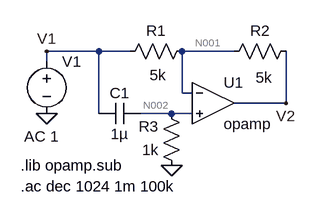
[diagram p0: schematic circuito1.asc]
circuito1.asc, the LTspice schematic file:
Version 4
SHEET 1 880 680
WIRE 96 96 16 96
WIRE 144 96 96 96
WIRE 304 96 224 96
WIRE 16 112 16 96
WIRE 224 160 224 96
WIRE 240 160 224 160
WIRE 384 176 384 96
WIRE 384 176 304 176
WIRE 96 192 96 96
WIRE 208 192 160 192
WIRE 240 192 208 192
FLAG 16 192 0
FLAG 208 272 0
FLAG 384 176 V2
FLAG 16 96 V1
SYMBOL res 240 80 R90
WINDOW 0 0 56 VBottom 2
WINDOW 3 37 53 VTop 2
SYMATTR InstName R1
SYMATTR Value 5k
SYMBOL res 400 80 R90
WINDOW 0 0 56 VBottom 2
WINDOW 3 41 50 VTop 2
SYMATTR InstName R2
SYMATTR Value 5k
SYMBOL res 224 288 R180
WINDOW 0 36 76 Left 2
WINDOW 3 36 40 Left 2
SYMATTR InstName R3
SYMATTR Value 1k
SYMBOL cap 160 176 R90
WINDOW 0 0 32 VBottom 2
WINDOW 3 32 32 VTop 2
SYMATTR InstName C1
SYMATTR Value 1µ
SYMBOL OpAmps\\opamp 272 112 R0
SYMATTR InstName U1
SYMBOL voltage 16 96 R0
WINDOW 123 -35 131 Left 2
WINDOW 39 0 0 Left 0
SYMATTR Value2 AC 1
SYMATTR InstName V1
SYMATTR Value ""
TEXT -24 272 Left 2 !.lib opamp.sub
TEXT -24 304 Left 2 !.ac dec 1024 1m 100k

The netlist it stands for:
* circuito1.asc
R1 N001 V1 5k
R2 V2 N001 5k
R3 0 N002 1k
C1 N002 V1 1µ
XU1 N001 N002 V2 opamp Aol=100K GBW=10Meg  ; pins invin noninvin out
V1 V1 0 AC 1
.lib opamp.sub
.ac dec 1024 1m 100k
.backanno
.end

* Results of the author's LTspice run, read from the files saved beside the schematic
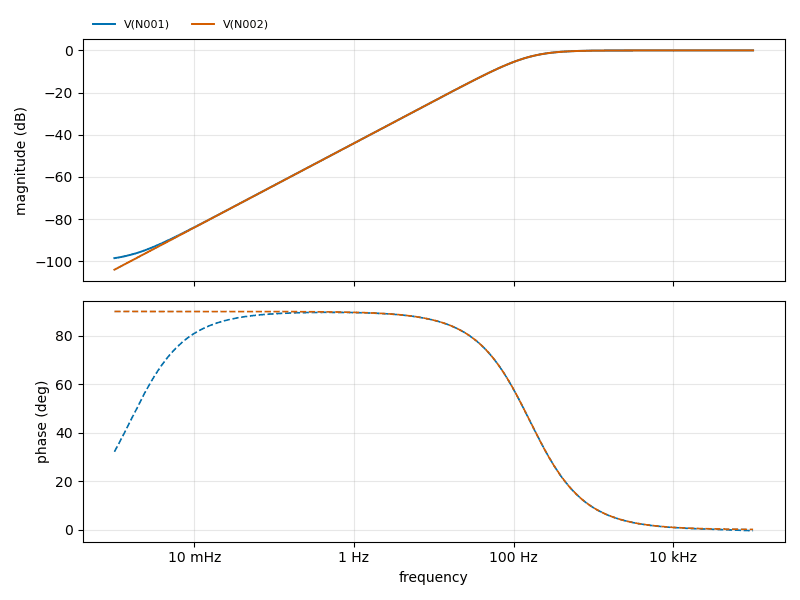
[diagram p1: AC Analysis of circuito1.asc, plotted from the saved traces]
* AC Analysis, 1 run:
*   V(N001): -98.55 dB at 1 mHz, -0.00 dB at 100 kHz, peak -0.00 dB at 30.3 kHz, 3 dB below the peak at 159.1 Hz
*   V(N002): -104.04 dB at 1 mHz, -0.00 dB at 100 kHz, peak -0.00 dB at 100 kHz, 3 dB below the peak at 159.2 Hz